# EAGLE schematic schematic (EAGLE 8.1.0)
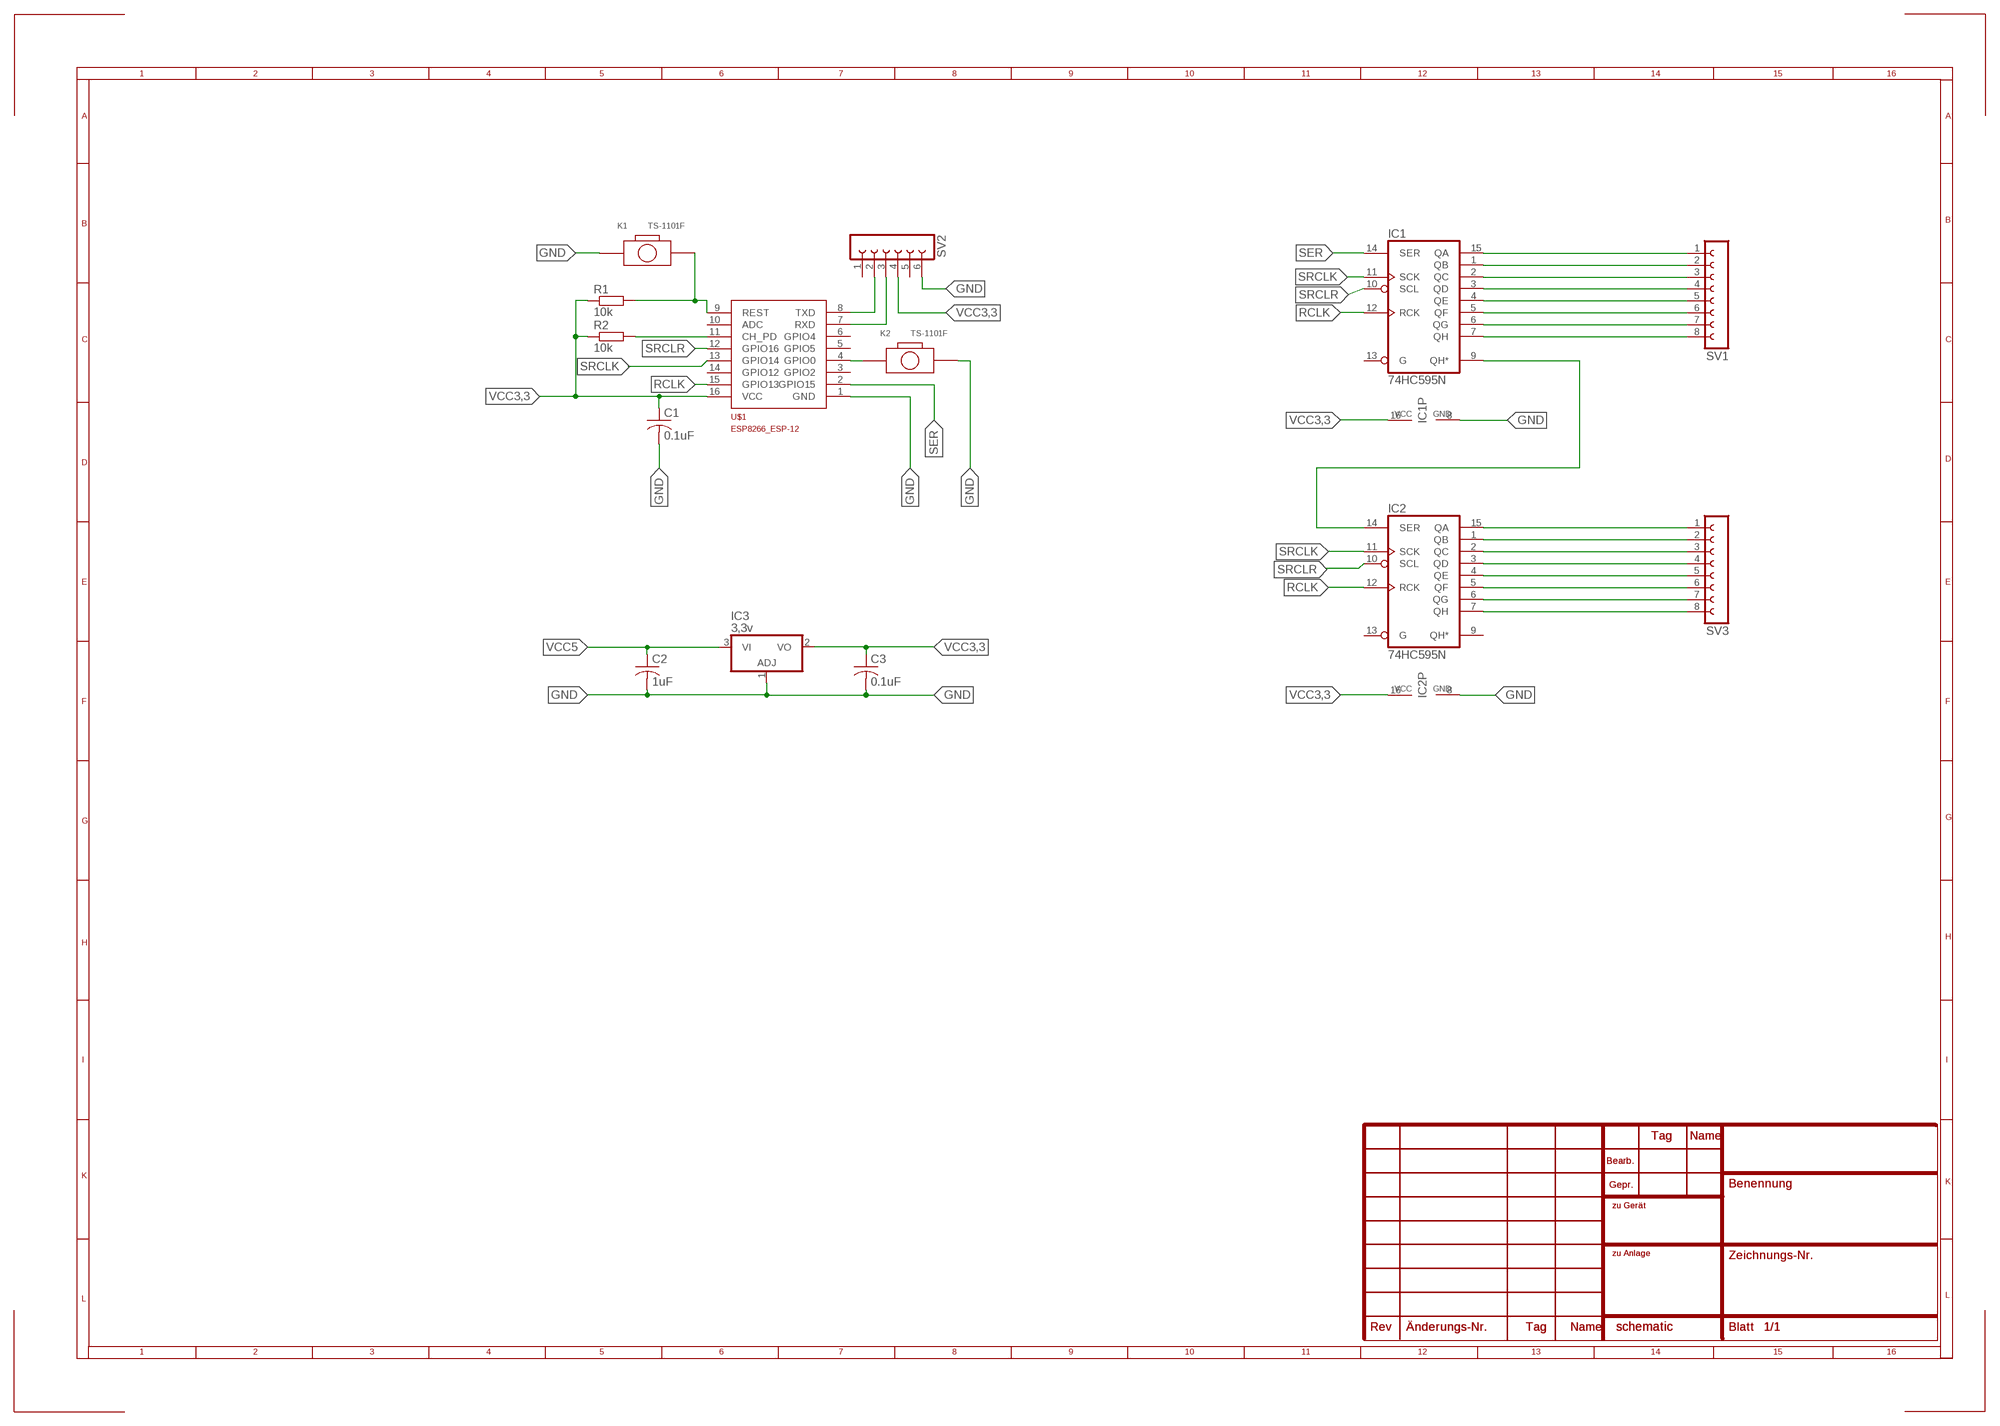
[diagram p0: schematic, sheet 1]

## Parts
C1  0.1uF  C-USC1608  [C1608]
C2  1uF  C-USC1608  [C1608]
C3  0.1uF  C-USC1608  [C1608]
IC1  74HC595N  [DIL16]
IC2  74HC595N  [DIL16]
IC3  3,3v  317T  [TO220H]
K1  TS-1101F  DIP-BUTTON-FRONT-WHITE(2P-3.4X6MM)  [SW2-3.4X6.0X3.55MM-90D]
K2  TS-1101F  DIP-BUTTON-FRONT-WHITE(2P-3.4X6MM)  [SW2-3.4X6.0X3.55MM-90D]
R1  10k  R-EU_R0805  [R0805]
R2  10k  R-EU_R0805  [R0805]
SV1  FE08-1  [FE08]
SV2  FE06-1  [FE06]
SV3  FE08-1  [FE08]
U$1  ESP8266_ESP-12  [ESP8266-ESP12]

## Nets
GND: C1.2 C2.2 C3.2 IC1.8(GND) IC2.8(GND) IC3.1(ADJ) K1.P$1 K2.P$2 SV2.6 U$1.1(GND)
N$1: IC1.9(QH*) IC2.14(SER)
N$2: K1.P$2 R1.2 U$1.9(REST)
N$3: R2.2 U$1.11(CH_PD)
N$4: SV2.2 U$1.8(TXD)
N$5: SV2.3 U$1.7(RXD)
N$6: K2.P$1 U$1.4(GPIO0)
N$7: IC2.15(QA) SV3.1
N$8: IC2.1(QB) SV3.2
N$9: IC2.2(QC) SV3.3
N$10: IC2.3(QD) SV3.4
N$11: IC2.4(QE) SV3.5
N$12: IC2.5(QF) SV3.6
N$13: IC2.6(QG) SV3.7
N$14: IC2.7(QH) SV3.8
N$15: IC1.15(QA) SV1.1
N$16: IC1.1(QB) SV1.2
N$17: IC1.2(QC) SV1.3
N$18: IC1.3(QD) SV1.4
N$19: IC1.4(QE) SV1.5
N$20: IC1.5(QF) SV1.6
N$21: IC1.6(QG) SV1.7
N$22: IC1.7(QH) SV1.8
RCLK: IC1.12(RCK) IC2.12(RCK) U$1.15(GPIO13)
SER: IC1.14(SER) U$1.2(GPIO15)
SRCLK: IC1.11(SCK) IC2.11(SCK) U$1.13(GPIO14)
SRCLR: IC1.10(SCL) IC2.10(SCL) U$1.12(GPIO16)
VCC3,3: C1.1 C3.1 IC1.16(VCC) IC2.16(VCC) IC3.2(VO) R1.1 R2.1 SV2.4 U$1.16(VCC)
VCC5: C2.1 IC3.3(VI)
Unconnected: IC1.13(G) IC2.9(QH*) IC2.13(G) SV2.1 SV2.5 U$1.3(GPIO2) U$1.5(GPIO5) U$1.6(GPIO4) U$1.10(ADC) U$1.14(GPIO12)

## Library data of the parts
C1-C3 = rcl:C-US: CAPACITOR, American symbol
IC1 IC2 = 74xx-eu:74*595: 8-bit SHIFT REGISTER, output latch
IC3 = linear:*317: Positive VOLTAGE REGULATOR
K1 K2 = Seeed-OPL-Button:DIP-BUTTON-FRONT-WHITE(2P-3.4X6MM): 311020025; MPN: TS-1101F
R1 R2 = resistor:R-EU_: RESISTOR, European symbol
SV1 SV3 = con-lsta:FE08-1: FEMALE HEADER; OC_FARNELL: unknown; OC_NEWARK: unknown
SV2 = con-lsta:FE06-1: FEMALE HEADER; OC_FARNELL: unknown; OC_NEWARK: unknown
U$1 = ESP8266-ESP12:ESP8266_ESP-12